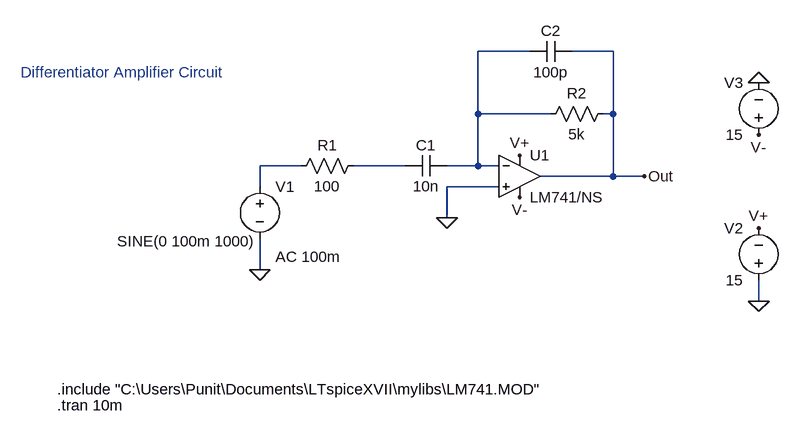
[diagram p0: schematic differentiator_amplifier.asc]
differentiator_amplifier.asc, the LTspice schematic file:
Version 4
SHEET 1 880 680
WIRE 368 -48 288 -48
WIRE 496 -48 432 -48
WIRE 288 48 288 -48
WIRE 400 48 288 48
WIRE 496 48 496 -48
WIRE 496 48 480 48
WIRE 16 128 -48 128
WIRE 176 128 96 128
WIRE 288 128 288 48
WIRE 288 128 240 128
WIRE 320 128 288 128
WIRE 496 144 496 48
WIRE 496 144 384 144
WIRE 544 144 496 144
WIRE -48 160 -48 128
WIRE 320 160 240 160
WIRE 240 208 240 160
WIRE -48 288 -48 240
WIRE 720 336 720 304
FLAG 240 208 0
FLAG 720 336 0
FLAG 720 0 0
FLAG 544 144 Out
FLAG -48 288 0
FLAG 720 80 V-
FLAG 720 224 V+
FLAG 352 176 V-
FLAG 352 112 V+
SYMBOL OpAmps\\opamp2 352 80 R0
SYMATTR InstName U1
SYMATTR Value LM741/NS
SYMBOL voltage -48 144 R0
WINDOW 3 -220 100 Left 2
WINDOW 123 24 124 Left 2
WINDOW 39 0 0 Left 0
SYMATTR Value SINE(0 100m 1000)
SYMATTR Value2 AC 100m
SYMATTR InstName V1
SYMBOL voltage 720 320 R180
WINDOW 0 24 96 Left 2
WINDOW 3 24 16 Left 2
WINDOW 123 0 0 Left 0
WINDOW 39 0 0 Left 0
SYMATTR InstName V2
SYMATTR Value 15
SYMBOL voltage 720 96 R180
WINDOW 0 24 96 Left 2
WINDOW 3 24 16 Left 2
WINDOW 123 0 0 Left 0
WINDOW 39 0 0 Left 0
SYMATTR InstName V3
SYMATTR Value 15
SYMBOL res 496 32 R90
WINDOW 0 0 56 VBottom 2
WINDOW 3 32 56 VTop 2
SYMATTR InstName R2
SYMATTR Value 5k
SYMBOL cap 240 112 R90
WINDOW 0 0 32 VBottom 2
WINDOW 3 32 32 VTop 2
SYMATTR InstName C1
SYMATTR Value 10n
SYMBOL res 112 112 R90
WINDOW 0 0 56 VBottom 2
WINDOW 3 32 56 VTop 2
SYMATTR InstName R1
SYMATTR Value 100
SYMBOL cap 432 -64 R90
WINDOW 0 0 32 VBottom 2
WINDOW 3 32 32 VTop 2
SYMATTR InstName C2
SYMATTR Value 100p
TEXT -360 472 Left 2 !.include "C:\\Users\\Punit\\Documents\\LTspiceXVII\\mylibs\\LM741.MOD"
TEXT -360 496 Left 2 !.tran 10m
TEXT -416 -16 Left 2 ;Differentiator Amplifier Circuit

The netlist it stands for:
* differentiator_amplifier.asc
XU1 0 N001 V+ V- Out LM741/NS  ; pins In+ In- V+ V- OUT
V1 N002 0 SINE(0 100m 1000) AC 100m
V2 0 V+ 15
V3 V- 0 15
R2 Out N001 5k
C1 N001 N003 10n
R1 N003 N002 100
C2 Out N001 100p
.include "C:\Users\Punit\Documents\LTspiceXVII\mylibs\LM741.MOD"
.tran 10m
* Differentiator Amplifier Circuit
.backanno
.end